# Altium project A300_Backplane.PrjPcb
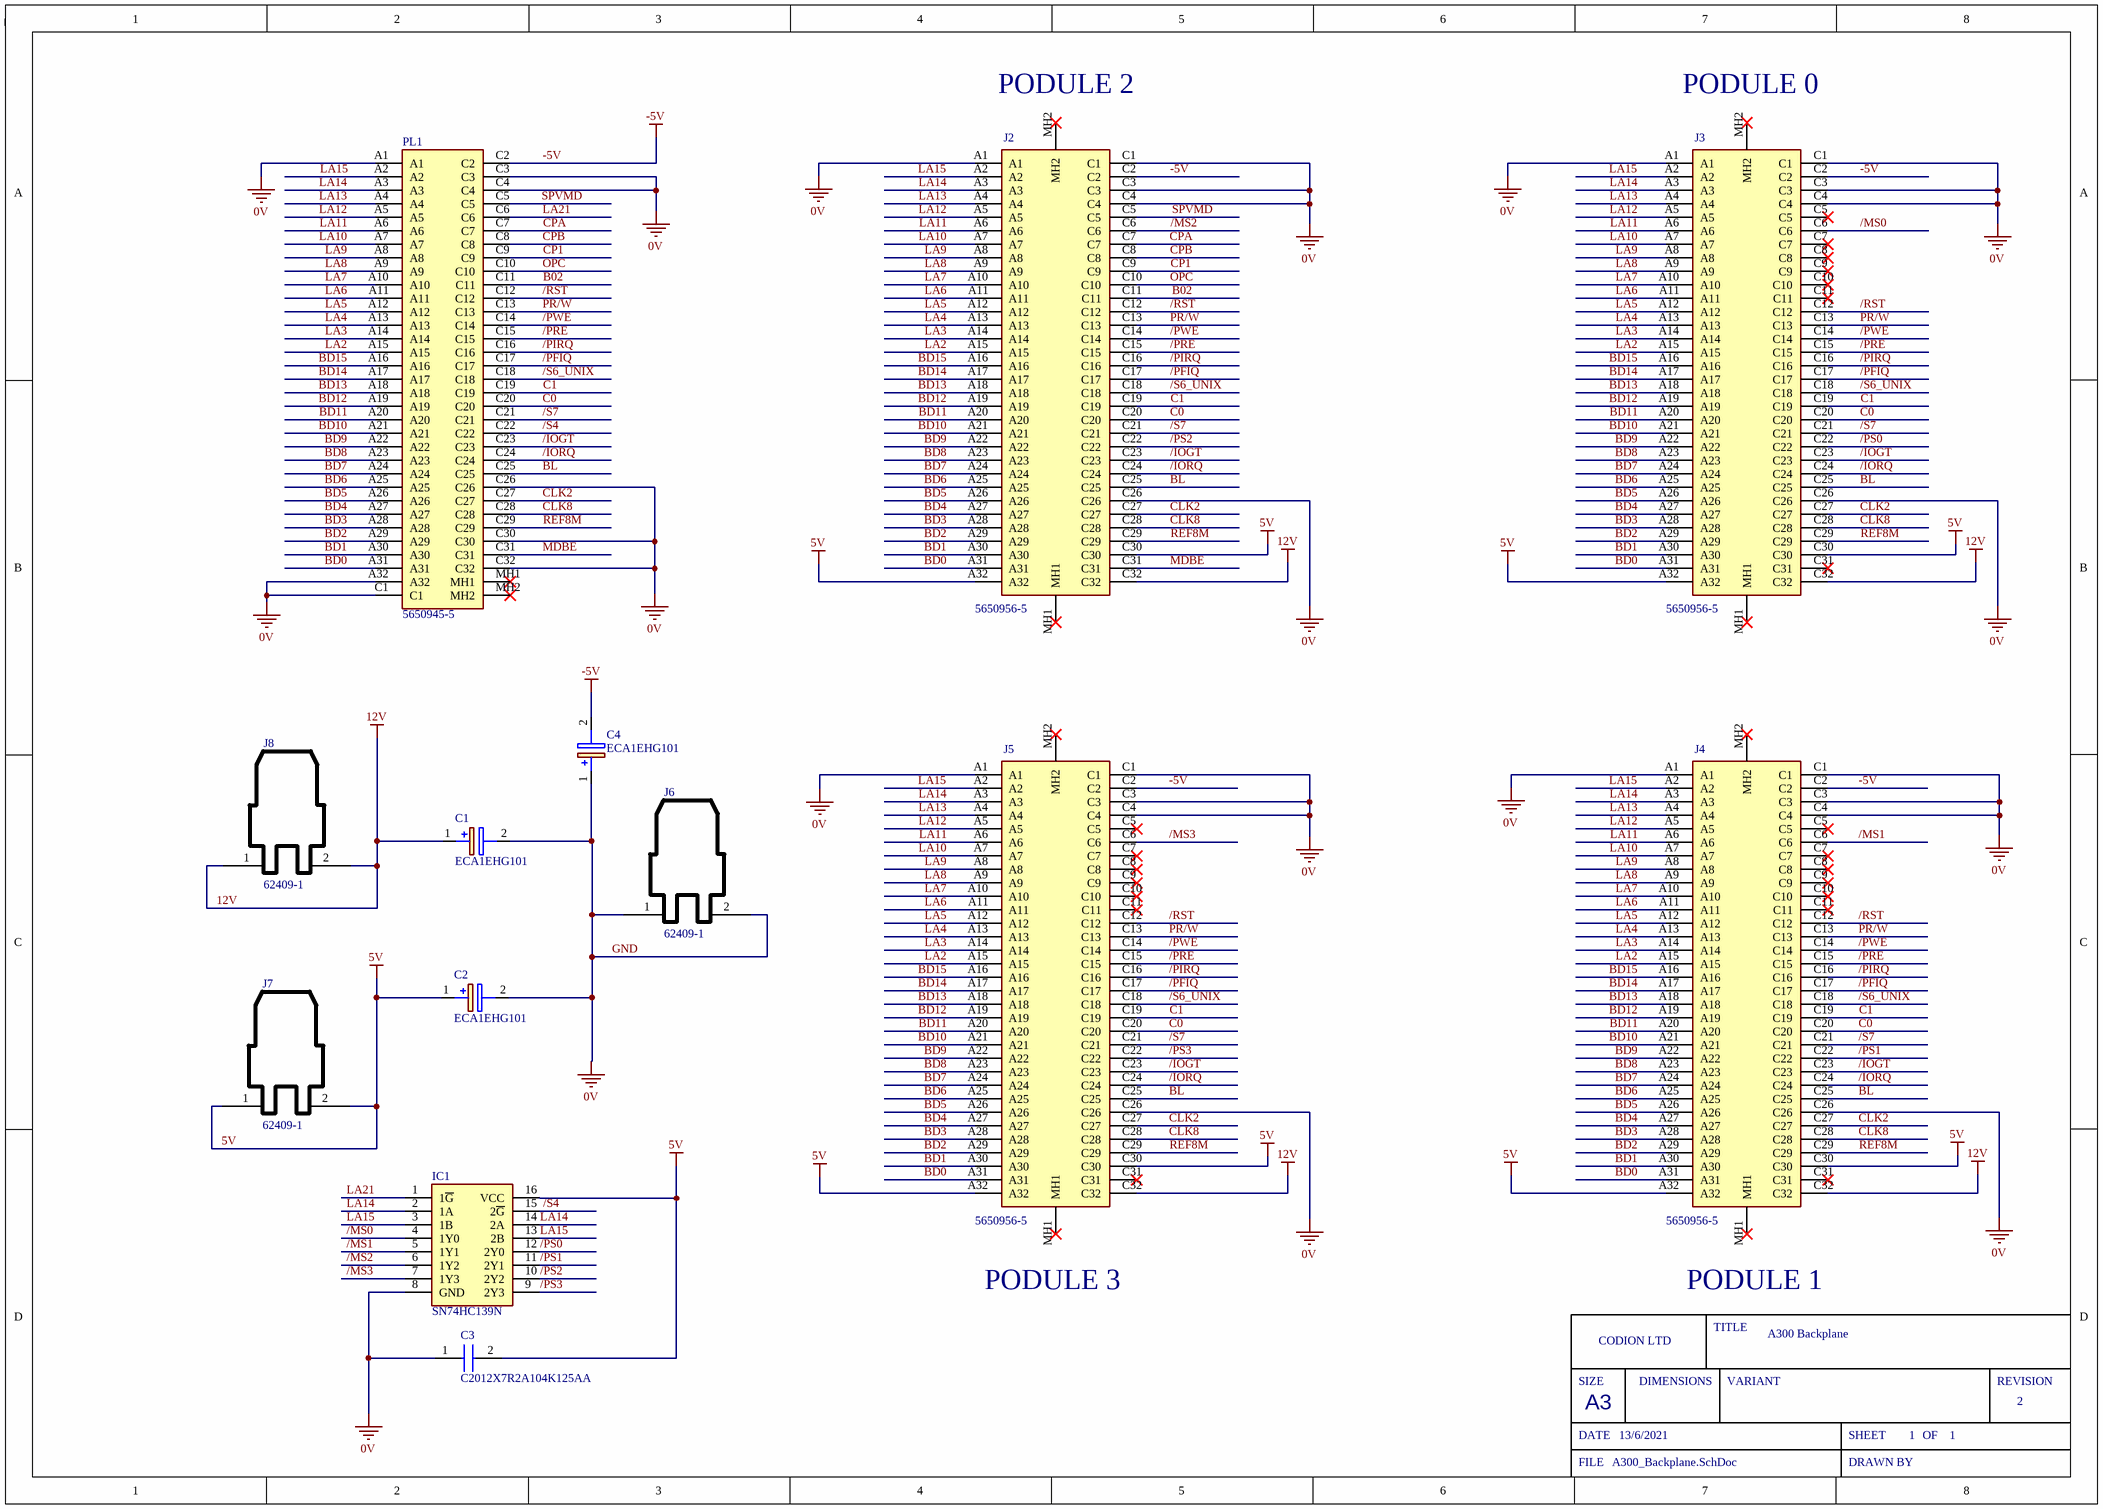
[diagram p0: A300_Backplane.SchDoc]
Project_Title: A300 Backplane; Sch_ReleaseDate: 13/6/2021; Sch_RevNo: 2
1 sheet, 13 parts. Net scope: global (net labels, ports and power ports of the same name join across sheets).
Board file: A300_Backplane.PcbDoc

## Sheet A300_Backplane.SchDoc
size A3; SheetNumber: 1; SheetTotal: 1

### Parts
C1  ECA1EHG101  [CAPPRD250W55D630H1220]
C2  ECA1EHG101  [CAPPRD250W55D630H1220]
C3  C2012X7R2A104K125AA  [CAPC2012X145N]
C4  ECA1EHG101  [CAPPRD250W55D630H1220]
IC1  SN74HC139N  [DIP794W53P254L1930H508Q16N]
J2  5650956-5  [56509565]
J3  5650956-5  [56509565]
J4  5650956-5  [56509565]
J5  5650956-5  [56509565]
J6  62409-1  [62409-1]
J7  62409-1  [62409-1]
J8  62409-1  [62409-1]
PL1  5650945-5  [56509455]

### Nets
5V: C2.1(+) C3.2 IC1.16(VCC) J2.A32 J2.C30 J3.A32 J3.C30 J4.A32 J4.C30 J5.A32 J5.C30 J7.1 J7.2
12V: C1.1(+) J2.C32 J3.C32 J4.C32 J5.C32 J8.1 J8.2
-5V: C4.2(-) J2.C2 J3.C2 J4.C2 J5.C2 PL1.C2
GND: C1.2(-) C2.2(-) C3.1 C4.1(+) IC1.8(GND) J2.A1 J2.C1 J2.C3 J2.C4 J2.C26 J3.A1 J3.C1 J3.C3 J3.C4 J3.C26 J4.A1 J4.C1 J4.C3 J4.C4 J4.C26 J5.A1 J5.C1 J5.C3 J5.C4 J5.C26 J6.1 J6.2 PL1.A1 PL1.A32 PL1.C1 PL1.C3 PL1.C4 PL1.C26 PL1.C30 PL1.C32  [also labelled 0V]
/IOGT: J2.C23 J3.C23 J4.C23 J5.C23 PL1.C23
/IORQ: J2.C24 J3.C24 J4.C24 J5.C24 PL1.C24
/MS0: IC1.4(1Y0) J3.C6
/MS1: IC1.5(1Y1) J4.C6
/MS2: IC1.6(1Y2) J2.C6
/MS3: IC1.7(1Y3) J5.C6
/PFIQ: J2.C17 J3.C17 J4.C17 J5.C17 PL1.C17
/PIRQ: J2.C16 J3.C16 J4.C16 J5.C16 PL1.C16
/PRE: J2.C15 J3.C15 J4.C15 J5.C15 PL1.C15
/PS0: IC1.12(2Y0) J3.C22
/PS1: IC1.11(2Y1) J4.C22
/PS2: IC1.10(2Y2) J2.C22
/PS3: IC1.9(2Y3) J5.C22
/PWE: J2.C14 J3.C14 J4.C14 J5.C14 PL1.C14
/RST: J2.C12 J3.C12 J4.C12 J5.C12 PL1.C12
/S4: IC1.15(2~{G}) PL1.C22
/S6_UNIX: J2.C18 J3.C18 J4.C18 J5.C18 PL1.C18
/S7: J2.C21 J3.C21 J4.C21 J5.C21 PL1.C21
B02: J2.C11 PL1.C11
BD0: J2.A31 J3.A31 J4.A31 J5.A31 PL1.A31
BD1: J2.A30 J3.A30 J4.A30 J5.A30 PL1.A30
BD2: J2.A29 J3.A29 J4.A29 J5.A29 PL1.A29
BD3: J2.A28 J3.A28 J4.A28 J5.A28 PL1.A28
BD4: J2.A27 J3.A27 J4.A27 J5.A27 PL1.A27
BD5: J2.A26 J3.A26 J4.A26 J5.A26 PL1.A26
BD6: J2.A25 J3.A25 J4.A25 J5.A25 PL1.A25
BD7: J2.A24 J3.A24 J4.A24 J5.A24 PL1.A24
BD8: J2.A23 J3.A23 J4.A23 J5.A23 PL1.A23
BD9: J2.A22 J3.A22 J4.A22 J5.A22 PL1.A22
BD10: J2.A21 J3.A21 J4.A21 J5.A21 PL1.A21
BD11: J2.A20 J3.A20 J4.A20 J5.A20 PL1.A20
BD12: J2.A19 J3.A19 J4.A19 J5.A19 PL1.A19
BD13: J2.A18 J3.A18 J4.A18 J5.A18 PL1.A18
BD14: J2.A17 J3.A17 J4.A17 J5.A17 PL1.A17
BD15: J2.A16 J3.A16 J4.A16 J5.A16 PL1.A16
BL: J2.C25 J3.C25 J4.C25 J5.C25 PL1.C25
C0: J2.C20 J3.C20 J4.C20 J5.C20 PL1.C20
C1: J2.C19 J3.C19 J4.C19 J5.C19 PL1.C19
CLK2: J2.C27 J3.C27 J4.C27 J5.C27 PL1.C27
CLK8: J2.C28 J3.C28 J4.C28 J5.C28 PL1.C28
CP1: J2.C9 PL1.C9
CPA: J2.C7 PL1.C7
CPB: J2.C8 PL1.C8
LA2: J2.A15 J3.A15 J4.A15 J5.A15 PL1.A15
LA3: J2.A14 J3.A14 J4.A14 J5.A14 PL1.A14
LA4: J2.A13 J3.A13 J4.A13 J5.A13 PL1.A13
LA5: J2.A12 J3.A12 J4.A12 J5.A12 PL1.A12
LA6: J2.A11 J3.A11 J4.A11 J5.A11 PL1.A11
LA7: J2.A10 J3.A10 J4.A10 J5.A10 PL1.A10
LA8: J2.A9 J3.A9 J4.A9 J5.A9 PL1.A9
LA9: J2.A8 J3.A8 J4.A8 J5.A8 PL1.A8
LA10: J2.A7 J3.A7 J4.A7 J5.A7 PL1.A7
LA11: J2.A6 J3.A6 J4.A6 J5.A6 PL1.A6
LA12: J2.A5 J3.A5 J4.A5 J5.A5 PL1.A5
LA13: J2.A4 J3.A4 J4.A4 J5.A4 PL1.A4
LA14: IC1.2(1A) IC1.14(2A) J2.A3 J3.A3 J4.A3 J5.A3 PL1.A3
LA15: IC1.3(1B) IC1.13(2B) J2.A2 J3.A2 J4.A2 J5.A2 PL1.A2
LA21: IC1.1(1~{G}) PL1.C6
MDBE: J2.C31 PL1.C31
OPC: J2.C10 PL1.C10
PR/W: J2.C13 J3.C13 J4.C13 J5.C13 PL1.C13
REF8M: J2.C29 J3.C29 J4.C29 J5.C29 PL1.C29
SPVMD: J2.C5 PL1.C5

Not connected (* = marked no-connect by the designer): J2 MH1* MH2*; J3 C5* C7* C8* C9* C10* C11* C31* MH1* MH2*; J4 C5* C7* C8* C9* C10* C11* C31* MH1* MH2*; J5 C5* C7* C8* C9* C10* C11* C31* MH1* MH2*; PL1 MH1* MH2*

### Notes on the sheet
- (near J2) PODULE 2
- (near J3) PODULE 0
- PODULE 3
- PODULE 1
- SIZE
- CODION LTD
- DIMENSIONS
- TITLE
- VARIANT
- REVISION
- DATE
- A3
- SHEET
- OF
- FILE
- DRAWN BY

### Library data of the parts
C1 C2 C4 = ECA1EHG101: Capacitor Polarised; Manufacturer_Name: Panasonic; Datasheet Link: http://industrial.panasonic.com/cdbs/www-data/pdf/RDF0000/ABA0000C1215.pdf; Height: 12.2mm; Manufacturer_Part_Number: ECA1EHG101
C3 = C2012X7R2A104K125AA: Capacitor; Manufacturer_Name: TDK; Datasheet Link: https://product.tdk.com/info/en/catalog/datasheets/mlcc_commercial_midvoltage_en.pdf; Height: 1.45mm; Manufacturer_Part_Number: C2012X7R2A104K125AA; Mouser Part Number: 810-C2012X7R2A104K; Mouser Price/Stock: https://www.mouser.co.uk/ProductDetail/TDK/C2012X7R2A104K125AA?qs=NRhsANhppD9J0ZsT2%2Fo%2F7Q%3D%3D; Arrow Part Number: C2012X7R2A104K125AA; Arrow Price/Stock: https://www.arrow.com/en/products/c2012x7r2a104k125aa/tdk
IC1 = SN74HC139N: Integrated Circuit; Manufacturer_Name: Texas Instruments; Datasheet Link: http://www.ti.com/lit/gpn/sn74hc139; Height: 5.08mm; Manufacturer_Part_Number: SN74HC139N; Mouser Part Number: 595-SN74HC139N; Mouser Price/Stock: https://www.mouser.co.uk/ProductDetail/Texas-Instruments/SN74HC139N/?qs=DcvZ7Fltd5wMzlxyLmVDxw%3D%3D; Arrow Part Number: SN74HC139N; Arrow Price/Stock: https://www.arrow.com/en/products/sn74hc139n/texas-instruments
J2-J5 = 5650956-5: Connector; Manufacturer_Name: TE Connectivity; Datasheet Link: https://componentsearchengine.com/Datasheets/2/5650956-5.pdf; Height: 11.51mm; Manufacturer_Part_Number: 5650956-5; Mouser Part Number: 571-5650956-5; Mouser Price/Stock: https://www.mouser.co.uk/ProductDetail/TE-Connectivity/5650956-5?qs=U4pz39agNJCw%2F9%252BN9Cdy%2Fg%3D%3D
J6-J8 = 982-0022: PCB Terminal, 6.35mm x 0.81mm, 0.25" x 0.032", Brass, 1.4 mm, Tin; Manufacturer: TE Coonectivity; Disti Part Number: 892609; Max Current: 24A; Cost(£): 0.807; Part Number: 982-0022; Value: 62409-1; ManuPart: 62409-1; Distributer: Farnell; ComponentLink1Description: Datasheet; ComponentLink1URL: Z:\HW_Common\A2E_Datasheets\TEConnectivity\1861797.pdf; RoHS Compliant: YES; Component Type: Standard
PL1 = 5650945-5: Connector; Manufacturer_Name: TE Connectivity; Datasheet Link: https://www.te.com/commerce/DocumentDelivery/DDEController?Action=showdoc&DocId=Customer+Drawing%7F650473%7FS%7Fpdf%7FEnglish%7FENG_CD_650473_S_baseFilename.pdf%7F5650945-5; Height: 11.1mm; Manufacturer_Part_Number: 5650945-5; Mouser Part Number: 571-5650945-5; Mouser Price/Stock: https://www.mouser.co.uk/ProductDetail/TE-Connectivity/5650945-5?qs=%2FFe7VTH785B%252B77b5t925bQ%3D%3D; Arrow Part Number: 5650945-5; Arrow Price/Stock: https://www.arrow.com/en/products/5650945-5/te-connectivity

## Assembly variants
STD: all parts fitted